# EAGLE design DR55_soundgen (EAGLE 7.1.0)
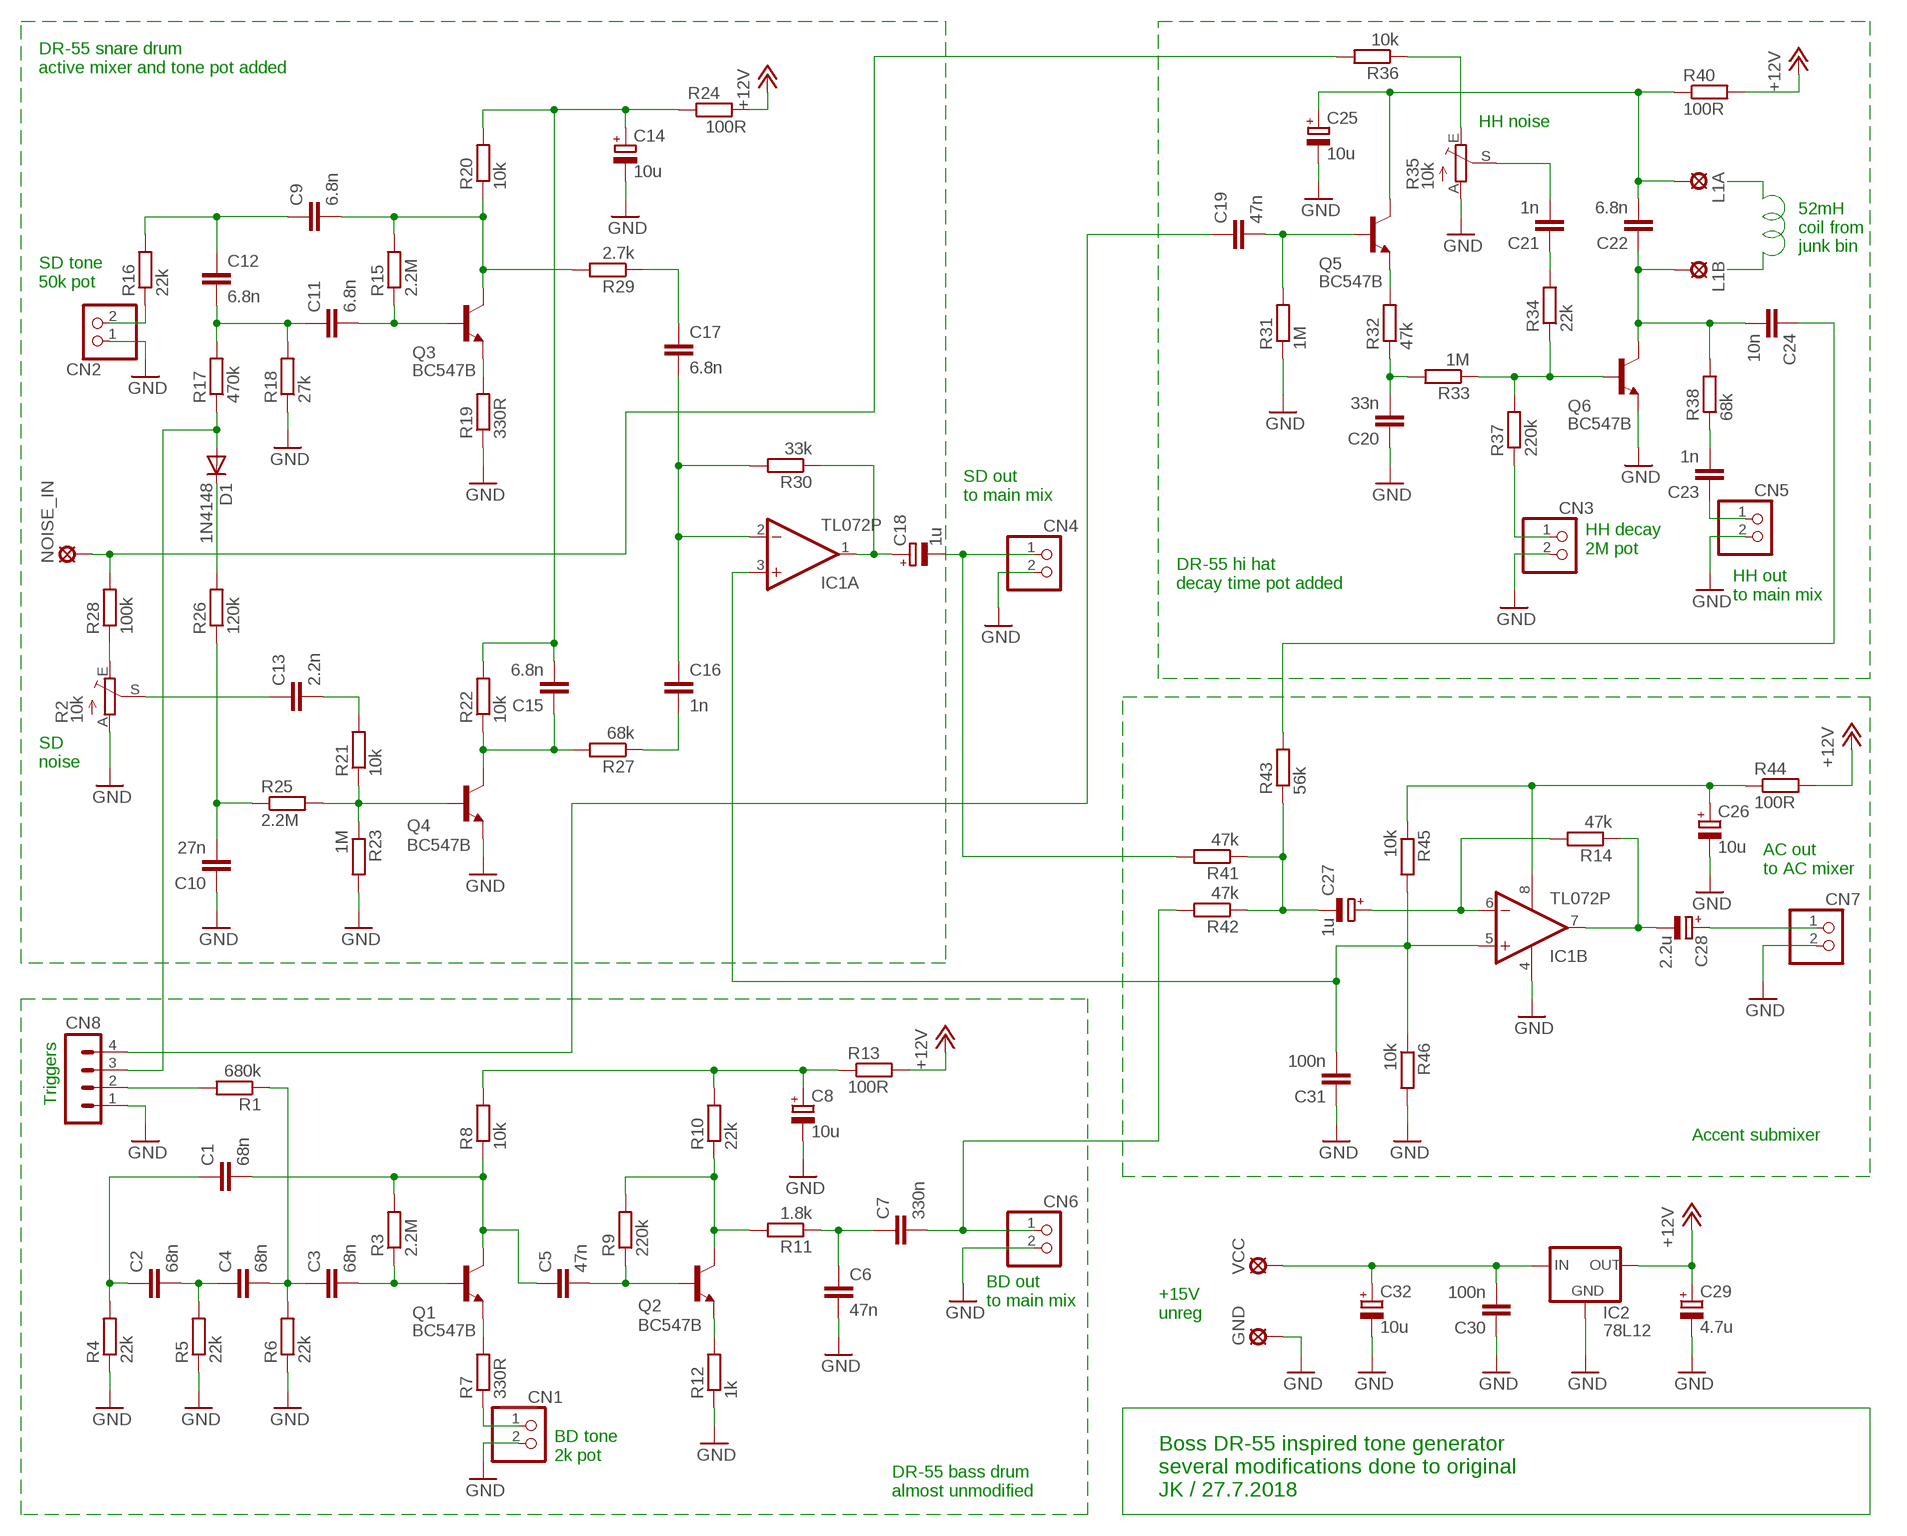
[diagram p0: schematic, sheet 1]

## Parts
C1  68n  C-EUC0805  [C0805]
C2  68n  C-EUC0805  [C0805]
C3  68n  C-EUC0805  [C0805]
C4  68n  C-EUC0805  [C0805]
C5  47n  C-EUC0805  [C0805]
C6  47n  C-EUC0805  [C0805]
C7  330n  C-EUC0805  [C0805]
C8  10u  CPOL-EUE5-5  [E5-5]
C9  6.8n  C-EUC0805  [C0805]
C10  27n  C-EUC0805  [C0805]
C11  6.8n  C-EUC0805  [C0805]
C12  6.8n  C-EUC0805  [C0805]
C13  2.2n  C-EUC0805  [C0805]
C14  10u  CPOL-EUE5-5  [E5-5]
C15  6.8n  C-EU025-024X044  [C025-024X044]
C16  1n  C-EUC0805  [C0805]
C17  6.8n  C-EUC0805  [C0805]
C18  1u  CPOL-EUSMCA  [SMC_A]
C19  47n  C-EUC0805  [C0805]
C20  33n  C-EUC0805  [C0805]
C21  1n  C-EUC0805  [C0805]
C22  6.8n  C-EUC0805  [C0805]
C23  1n  C-EUC0805  [C0805]
C24  10n  C-EUC0805  [C0805]
C25  10u  CPOL-EUE5-5  [E5-5]
C26  10u  CPOL-EUE5-5  [E5-5]
C27  1u  CPOL-EUSMCA  [SMC_A]
C28  2.2u  CPOL-EUE5-5  [E5-5]
C29  4.7u  CPOL-EUSMCA  [SMC_A]
C30  100n  C-EUC0805  [C0805]
C31  100n  C-EUC0805  [C0805]
C32  10u  CPOL-EUE5-5  [E5-5]
CN1  PINHD-1X2  [1X02]
CN2  PINHD-1X2  [1X02]
CN3  PINHD-1X2  [1X02]
CN4  PINHD-1X2  [1X02]
CN5  PINHD-1X2  [1X02]
CN6  PINHD-1X2  [1X02]
CN7  PINHD-1X2  [1X02]
CN8  MA04-1  [MA04-1]
D1  1N4148  DIODE-SOD80C  [SOD80C]
GND  LSP10  [LSP10]
IC1  TL072P  [DIL08]
IC2  78L12  78LXX  [78LXX]
L1A  MCS10B  [MCS10B]
L1B  MCS10B  [MCS10B]
NOISE_IN  LSP10  [LSP10]
Q1  BC547B  [TO92]
Q2  BC547B  [TO92]
Q3  BC547B  [TO92]
Q4  BC547B  [TO92]
Q5  BC547B  [TO92]
Q6  BC547B  [TO92]
R1  680k  R-EU_R0805  [R0805]
R2  10k  TRIM_EU-S63X  [S63X]
R3  2.2M  R-EU_R0805  [R0805]
R4  22k  R-EU_R0805  [R0805]
R5  22k  R-EU_R0805  [R0805]
R6  22k  R-EU_R0805  [R0805]
R7  330R  R-EU_R0805  [R0805]
R8  10k  R-EU_R0805  [R0805]
R9  220k  R-EU_R0805  [R0805]
R10  22k  R-EU_R0805  [R0805]
R11  1.8k  R-EU_R0805  [R0805]
R12  1k  R-EU_R0805  [R0805]
R13  100R  R-EU_R0805  [R0805]
R14  47k  R-EU_R0805  [R0805]
R15  2.2M  R-EU_R0805  [R0805]
R16  22k  R-EU_R0805  [R0805]
R17  470k  R-EU_R0805  [R0805]
R18  27k  R-EU_R0805  [R0805]
R19  330R  R-EU_R0805  [R0805]
R20  10k  R-EU_R0805  [R0805]
R21  10k  R-EU_R0805  [R0805]
R22  10k  R-EU_R0805  [R0805]
R23  1M  R-EU_R0805  [R0805]
R24  100R  R-EU_R0805  [R0805]
R25  2.2M  R-EU_R0805  [R0805]
R26  120k  R-EU_R0805  [R0805]
R27  68k  R-EU_R0805  [R0805]
R28  100k  R-EU_R0805  [R0805]
R29  2.7k  R-EU_R0805  [R0805]
R30  33k  R-EU_R0805  [R0805]
R31  1M  R-EU_R0805  [R0805]
R32  47k  R-EU_0207/10  [0207/10]
R33  1M  R-EU_R0805  [R0805]
R34  22k  R-EU_R0805  [R0805]
R35  10k  TRIM_EU-S63X  [S63X]
R36  10k  R-EU_R0805  [R0805]
R37  220k  R-EU_R0805  [R0805]
R38  68k  R-EU_R0805  [R0805]
R40  100R  R-EU_R0805  [R0805]
R41  47k  R-EU_R0805  [R0805]
R42  47k  R-EU_R0805  [R0805]
R43  56k  R-EU_R0805  [R0805]
R44  100R  R-EU_R0805  [R0805]
R45  10k  R-EU_R0805  [R0805]
R46  10k  R-EU_R0805  [R0805]
VCC  LSP10  [LSP10]

## Nets
+12V: C29.+ IC2.OUT R13.2 R24.2 R40.2 R44.2
+15V: C30.2 C32.+ IC2.IN VCC.MP
GND: C6.2 C8.- C10.1 C14.- C20.1 C25.- C26.- C29.- C30.1 C31.1 C32.- CN1.2 CN2.1 CN3.2 CN4.2 CN5.2 CN6.2 CN7.2 CN8.1 GND.MP IC1.4(P:V-) IC2.GND Q4.1(E) Q6.1(E) R2.A R4.1 R5.1 R6.1 R12.1 R18.1 R19.1 R23.2 R31.1 R35.A R46.2
N$1: C1.1 C2.1 R4.2
N$2: C2.2 C4.1 R5.2
N$3: C3.1 C4.2 R1.1 R6.2
N$4: C3.2 Q1.2(B) R3.1
N$5: Q1.1(E) R7.2
N$6: CN1.1 R7.1
N$7: C1.2 C5.1 Q1.3(C) R3.2 R8.1
N$8: C9.1 C12.1 R16.2
N$9: C5.2 Q2.2(B) R9.1
N$10: R2.E R28.1
N$11: Q2.3(C) R9.2 R10.1 R11.2
N$12: Q2.1(E) R12.2
N$13: C6.1 C7.1 R11.1
N$14: C11.1 C12.2 R17.2 R18.2
N$15: C11.2 Q3.2(B) R15.1
N$16: Q3.1(E) R19.2
N$17: CN2.2 R16.1
N$18: C9.2 Q3.3(C) R15.2 R20.1 R29.2
N$19: D1.C R26.2
N$20: C15.1 Q4.3(C) R22.1 R27.2
N$21: C10.2 R25.1 R26.1
N$22: Q4.2(B) R21.1 R23.1 R25.2
N$23: C13.2 R21.2
N$24: C16.2 R27.1
N$25: C19.2 Q5.2(B) R31.2
N$27: C13.1 R2.S
N$28: C17.1 R29.1
N$29: C16.1 C17.2 IC1.2(A:-IN) R30.2
N$30: Q5.1(E) R32.2
N$31: C18.+ IC1.1(A:OUT) R30.1
N$32: C20.2 R32.1 R33.2
N$33: Q6.2(B) R33.1 R34.1 R37.2
N$34: CN3.1 R37.1
N$36: C22.1 C24.2 L1B.MP Q6.3(C) R38.2
N$37: C23.2 R38.1
N$38: C21.1 R34.2
N$39: C21.2 R35.S
N$40: R35.E R36.1
N$41: C27.- R41.1 R42.1 R43.1
N$42: C28.- IC1.7(B:OUT) R14.1
N$43: C27.+ IC1.6(B:-IN) R14.2
NOISE_IN: NOISE_IN.MP R28.2 R36.2
OUT_AC: C28.+ CN7.1
OUT_BD: C7.2 CN6.1 R42.2
OUT_HH: C23.1 CN5.1
OUT_HH_AC: C24.1 R43.2
OUT_SD: C18.- CN4.1 R41.2
TRIG_BD: CN8.2 R1.2
TRIG_HH: C19.1 CN8.4
TRIG_SD: CN8.3 D1.A R17.1
V_BD: C8.+ R8.2 R10.2 R13.1
V_HH: C22.2 C25.+ L1A.MP Q5.3(C) R40.1
V_MX: C26.+ IC1.8(P:V+) R44.1 R45.1
V_MX/2: C31.2 IC1.3(A:+IN) IC1.5(B:+IN) R45.2 R46.1
V_SD: C14.+ C15.2 R20.2 R22.2 R24.1

## Notes on the sheet
- DR-55 snare drum
  active mixer and tone pot added
- HH noise
- 52mH
  coil from
  junk bin
- SD tone
  50k pot
- SD out
  to main mix
- HH decay
  2M pot
- HH out
  to main mix
- DR-55 hi hat
  decay time pot added
- SD
  noise
- AC out
  to AC mixer
- Triggers
- Accent submixer
- BD out
  to main mix
- +15V
  unreg
- BD tone
  2k pot
- DR-55 bass drum
  almost unmodified
- Boss DR-55 inspired tone generator
  several modifications done to original
  JK / 27.7.2018

## Library data of the parts
C1-C7 C9-C13 C15-C17 C19-C24 C30 C31 = rcl:C-EU: CAPACITOR, European symbol
C8 C14 C18 C25-C29 C32 = rcl:CPOL-EU: POLARIZED CAPACITOR, European symbol
CN1-CN7 = pinhead:PINHD-1X2: PIN HEADER
CN8 = con-lstb:MA04-1: PIN HEADER; OC_FARNELL: unknown; OC_NEWARK: unknown
D1 = diode:DIODE-: DIODE
GND NOISE_IN VCC = solpad:LSP10: SOLDER PAD drill 1.0 mm, distributor Buerklin, 12H555
IC1 = linear:TL072: OP AMP
IC2 = v-reg:78LXX: VOLTAGE REGULATOR
L1A L1B = solpad:MCS10B: SOLDER PAD MC S1, distributor Buerklin, 15F505
Q1-Q6 = transistor-npn:BC547*: NPN Transistor
R1 R3-R34 R36-R38 R40-R46 = rcl:R-EU_: RESISTOR, European symbol
R2 R35 = pot:TRIM_EU-: POTENTIOMETER

## Board
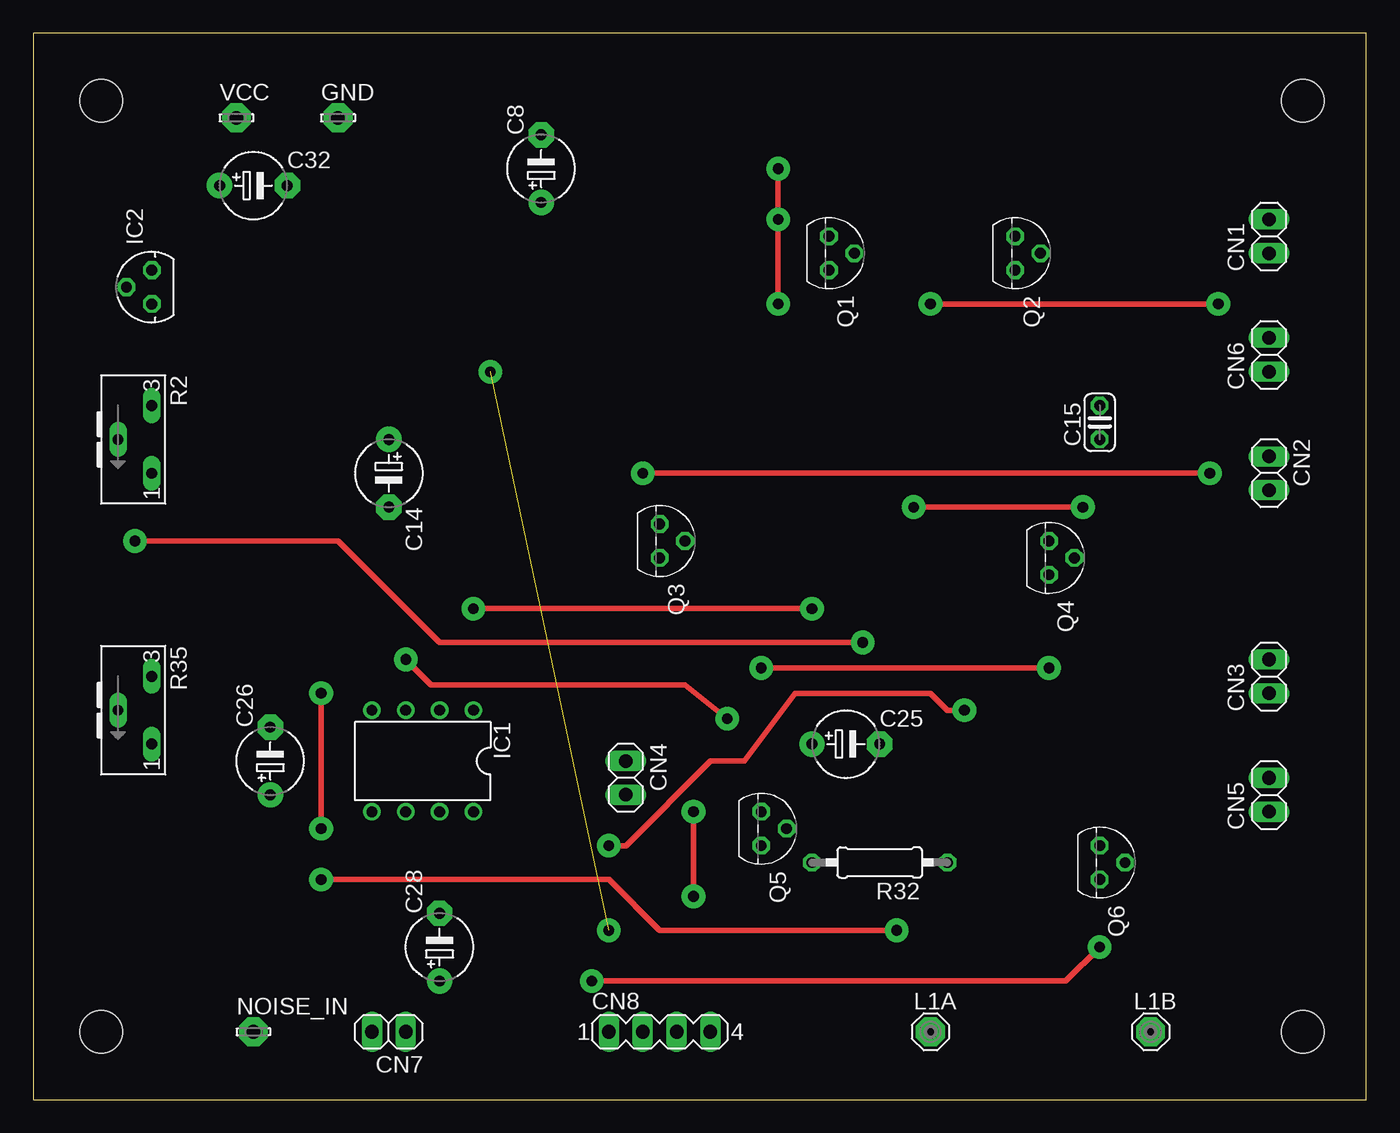
[diagram p1: board, top side]
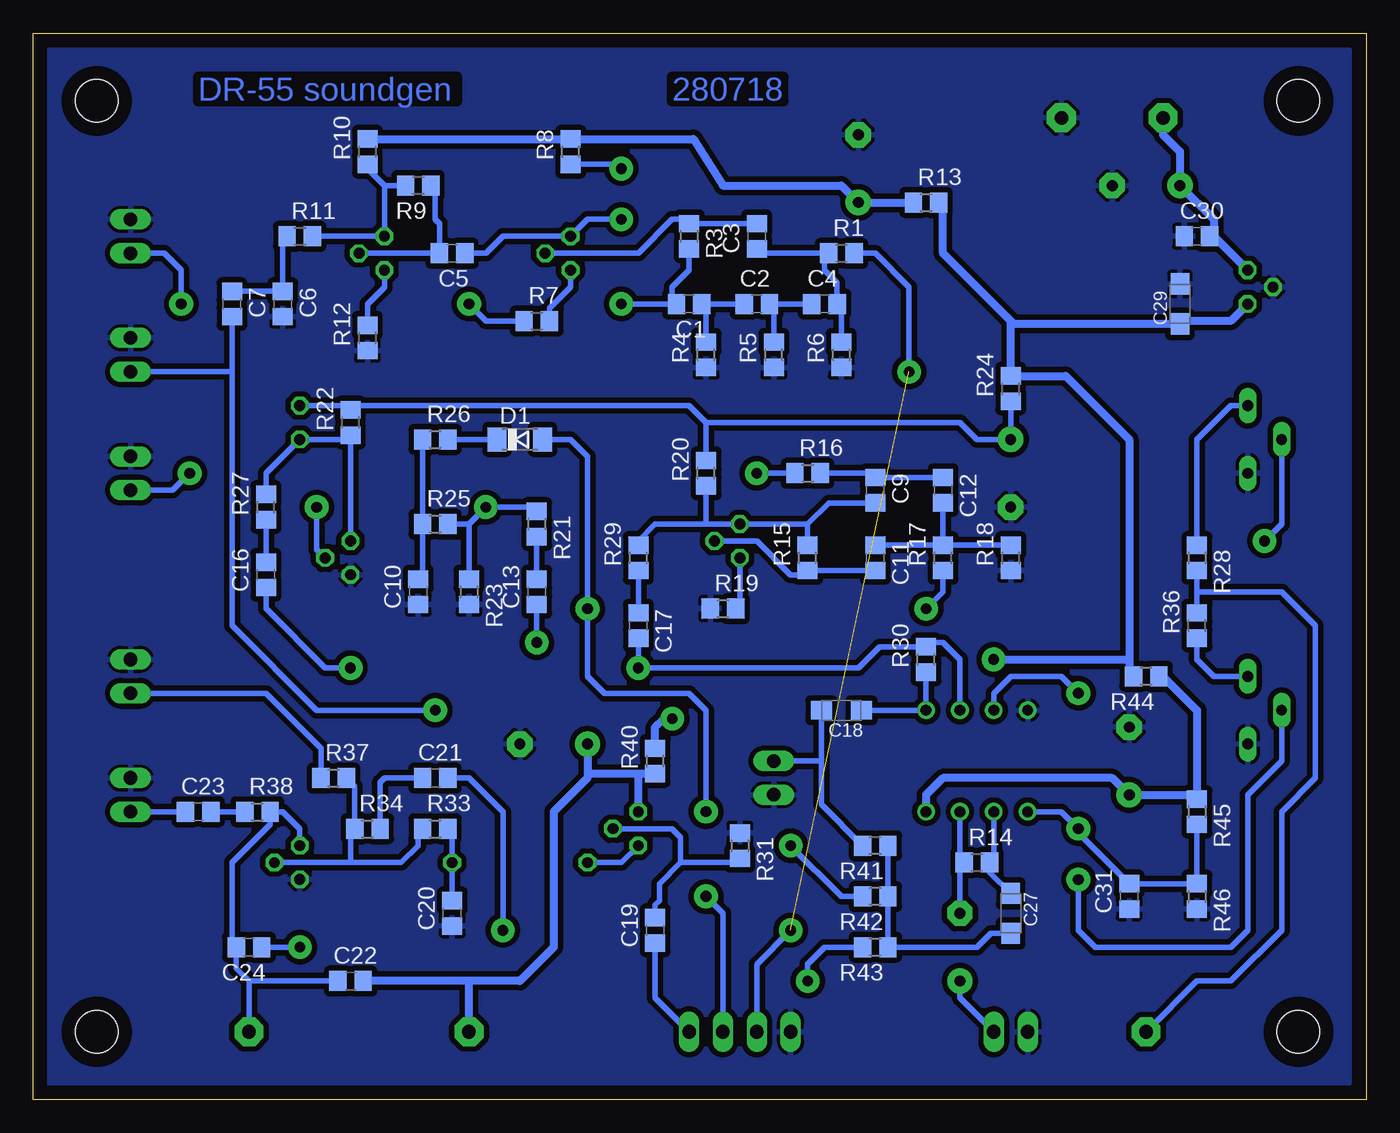
[diagram p2: board, bottom side, seen from below]

Size 100 x 80 mm. Coordinates in mm from the lower left corner, seen from the top.
Outline: 0,0 100,0 100,80 0,80 0,0
Copper layers (1*16): Top 0.035mm / dielectric 1.5mm / Bottom 0.035mm
Design rules "default": minimum track width 10mil, minimum drill 24mil, track to track 8mil, track to pad 8mil, pad to pad 8mil, via to via 8mil, smd to smd 8mil, copper to edge 40mil, drill to drill 8mil, minimum pad ring 10mil, minimum via ring 8mil, stop-mask expansion 4mil, vias tented up to drill 0mil, thermal gap 10mil
Holes 3.2 mm at 5.08,5.08 5.08,74.93 95.25,74.93 95.25,5.08

### Footprints (pad centres in the part's own frame; a part is rotated, then mirrored left to right if it is on the bottom)
C0805 = smd 1.3 x 1.5: 1 -0.95,0; 2 0.95,0
E5-5 = drill 0.813 pad 1.905: + -2.54,0 | drill 0.813 pad 1.905 octagon: - 2.54,0
C025-024X044 = drill 0.813 octagon: 1 -1.27,0; 2 1.27,0
SMC_A = smd 1.6 x 1.4: + -1.5,0; - 1.5,0
1X02 = drill 1.016 long: 1 -1.27,0; 2 1.27,0
MA04-1 = drill 1.016 long: 1 -3.81,0; 2 -1.27,0; 3 1.27,0; 4 3.81,0
SOD80C = smd 1.4 x 1.8: A 1.7,0; C -1.7,0
LSP10 = drill 1.016 pad 2.159 octagon: MP 0,0
DIL08 = drill 0.813 pad 1.27: 1 -3.81,-3.81; 2 -1.27,-3.81; 3 1.27,-3.81; 4 3.81,-3.81; 5 3.81,3.81; 6 1.27,3.81; 7 -1.27,3.81; 8 -3.81,3.81
78LXX = drill 0.813 octagon: GND 0,1.905; IN 1.27,0; OUT -1.27,0
MCS10B = drill 1.016 pad 2.159 octagon: MP 0,0
TO92 = drill 0.813 octagon: 1 1.27,0; 2 0,1.905; 3 -1.27,0
R0805 = smd 1.3 x 1.5: 1 -0.95,0; 2 0.95,0
S63X = drill 0.813 long: A 2.54,0; E -2.54,0; S 0,-2.54
0207/10 = drill 0.813 octagon: 1 -5.08,0; 2 5.08,0

### Placement (x,y rotation side)
C1  50.8,59.69 180 bottom
C2  45.72,59.69 0 bottom
C3  45.72,64.77 90 bottom
C4  40.64,59.69 0 bottom
C5  68.58,63.5 180 bottom
C6  81.28,59.69 270 bottom
C7  85.09,59.69 270 bottom
C8  38.1,69.85 90 top
C9  36.83,45.72 270 bottom
C10  71.12,38.1 90 bottom
C11  36.83,40.64 270 bottom
C12  31.75,45.72 270 bottom
C13  62.23,38.1 90 bottom
C14  26.67,46.99 270 top
C15  80.01,50.8 90 top
C16  82.55,39.37 90 bottom
C17  54.61,35.56 270 bottom
C18  39.37,29.21 180 bottom
C19  53.34,12.7 90 bottom
C20  68.58,13.97 90 bottom
C21  69.85,24.13 0 bottom
C22  76.2,8.89 0 bottom
C23  87.63,21.59 0 bottom
C24  83.82,11.43 180 bottom
C25  60.96,26.67 0 top
C26  17.78,25.4 90 top
C27  26.67,13.97 270 bottom
C28  30.48,11.43 90 top
C29  13.97,59.69 90 bottom
C30  12.7,64.77 0 bottom
C31  17.78,15.24 90 bottom
C32  16.51,68.58 0 top
CN1  92.71,64.77 90 top
CN2  92.71,46.99 270 top
CN3  92.71,31.75 90 top
CN4  44.45,24.13 270 top
CN5  92.71,22.86 90 top
CN6  92.71,55.88 90 top
CN7  26.67,5.08 180 top
CN8  46.99,5.08 0 top
D1  63.5,49.53 0 bottom
GND  22.86,73.66 0 top
IC1  29.21,25.4 180 top
IC2  8.89,60.96 90 top
L1A  67.31,5.08 0 top
L1B  83.82,5.08 0 top
NOISE_IN  16.51,5.08 0 top
Q1  59.69,63.5 270 top
Q2  73.66,63.5 270 top
Q3  46.99,41.91 270 top
Q4  76.2,40.64 270 top
Q5  54.61,20.32 270 top
Q6  80.01,17.78 270 top
R1  39.37,63.5 0 bottom
R2  8.89,49.53 270 top
R3  50.8,64.77 270 bottom
R4  49.53,55.88 90 bottom
R5  44.45,55.88 90 bottom
R6  39.37,55.88 90 bottom
R7  62.23,58.42 0 bottom
R8  59.69,71.12 90 bottom
R9  71.12,68.58 180 bottom
R10  74.93,71.12 90 bottom
R11  80.01,64.77 0 bottom
R12  74.93,57.15 90 bottom
R13  33.02,67.31 0 bottom
R14  29.21,17.78 0 bottom
R15  41.91,40.64 90 bottom
R16  41.91,46.99 0 bottom
R17  31.75,40.64 90 bottom
R18  26.67,40.64 90 bottom
R19  48.26,36.83 0 bottom
R20  49.53,46.99 90 bottom
R21  62.23,43.18 270 bottom
R22  76.2,50.8 90 bottom
R23  67.31,38.1 270 bottom
R24  26.67,53.34 90 bottom
R25  69.85,43.18 0 bottom
R26  69.85,49.53 0 bottom
R27  82.55,44.45 90 bottom
R28  12.7,40.64 270 bottom
R29  54.61,40.64 90 bottom
R30  33.02,33.02 90 bottom
R31  46.99,19.05 270 bottom
R32  63.5,17.78 180 top
R33  69.85,20.32 0 bottom
R34  74.93,20.32 0 bottom
R35  8.89,29.21 270 top
R36  12.7,35.56 90 bottom
R37  77.47,24.13 0 bottom
R38  83.19,21.59 0 bottom
R40  53.34,25.4 90 bottom
R41  36.83,19.05 180 bottom
R42  36.83,15.24 180 bottom
R43  36.83,11.43 180 bottom
R44  16.51,31.75 180 bottom
R45  12.7,21.59 270 bottom
R46  12.7,15.24 270 bottom
VCC  15.24,73.66 0 top

### Tracks (layer width: path | path; a pad name or v marks a point on that pad's centre or on a via)
+12V  (via drill 0.8 pad 1.78)
  Top 0.406: v52.07,28.57 48.9,31.11 29.84,31.11 v27.94,33.02
  Bottom 0.406: 13.74,58.42 C29.+ | 31.75,66.99 R13.2 | 17.78,32.07 R44.2
  Bottom 0.61: IC2.OUT 10.16,58.42 13.74,58.42 | C29.+ 26.44,58.19 | 26.44,58.19 26.67,58.19 R24.2 22.54,54.29 17.78,49.53 17.78,33.02 | 26.44,58.19 31.75,63.5 31.75,66.99 | R40.2 53.34,27.94 52.7,28.57 v52.07,28.57 | v27.94,33.02 17.78,33.02 | 17.78,33.02 17.78,32.07
+15V
  Bottom 0.406: 11.43,65.09 C30.2 11.43,64.77
  Bottom 0.61: VCC.MP 15.24,72.39 13.97,71.12 C32.+ 11.43,66.04 11.43,65.09 | 11.43,64.77 IC2.IN
GND
  pour Bottom (isolate 0.406): 1.27,78.74 99.06,78.74 99.06,1.27 1.27,1.27
N$1
  Bottom 0.406: R4.2 49.53,59.37 C1.1 C2.1
N$2
  Bottom 0.406: R5.2 44.45,59.37 C2.2 C4.1
N$3
  Bottom 0.406: R6.2 39.37,59.37 C4.2 39.69,61.28 40.64,62.23 40.64,63.18 R1.1 45.4,63.5 C3.1
N$4
  Bottom 0.406: Q1.2 54.61,63.5 52.07,66.04 51.12,66.04 R3.1 C3.2
N$5
  Bottom 0.406: R7.2 61.28,59.37 59.69,60.96 Q1.1
N$6  (via drill 0.8 pad 1.78)
  Top 0.406: v67.31,59.69 v88.9,59.69
  Bottom 0.406: R7.1 66.04,58.42 v67.31,59.69 | v88.9,59.69 88.9,62.23 90.17,63.5 CN1.1
N$7  (via drill 0.8 pad 1.78)
  Top 0.406: v55.88,59.69 v55.88,66.04 v55.88,69.85
  Bottom 0.406: C5.1 66.04,63.5 64.77,64.77 Q1.3 58.42,66.04 v55.88,66.04 | R3.2 50.8,62.23 52.07,60.96 52.07,60.01 C1.2 v55.88,59.69 | R8.1 56.2,70.17 v55.88,69.85
N$8
  Bottom 0.406: C12.1 C9.1 37.15,46.99 R16.2
N$9
  Bottom 0.406: Q2.2 C5.2 69.53,65.72 69.85,66.04 69.85,68.26 R9.1
N$10
  Bottom 0.406: R28.1 12.7,49.53 10.16,52.07 R2.E
N$11
  Bottom 0.406: R11.2 Q2.3 73.66,68.58 | 73.66,68.58 R9.2 | R10.1 74.93,69.85 73.66,68.58
N$12
  Bottom 0.406: Q2.1 73.66,60.96 74.93,59.69 R12.2
N$13
  Bottom 0.406: C6.1 81.28,64.77 R11.1 | 81.59,60.33 C6.1 | 81.6,60.96 C6.1 | C7.1 C6.1
N$14
  Bottom 0.406: C12.2 R17.2 | R18.2 R17.2 | R17.2 C11.1
N$15
  Bottom 0.406: Q3.2 45.72,41.91 43.18,39.37 42.23,39.37 R15.1 C11.2
N$16
  Bottom 0.406: Q3.1 46.99,37.15 R19.2
N$17  (via drill 0.8 pad 1.78)
  Top 0.406: v45.72,46.99 v88.27,46.99
  Bottom 0.406: R16.1 v45.72,46.99 | v88.27,46.99 89.53,45.72 CN2.2
N$18
  Bottom 0.406: C9.2 40.32,44.77 41.91,43.18 | 41.91,43.18 R15.2 | 41.91,43.18 Q3.3 49.53,43.18 | 49.53,43.18 53.34,43.18 54.61,41.91 R29.2 | R20.1 49.53,43.18
N$19
  Bottom 0.406: D1.C R26.2
N$20
  Bottom 0.406: R27.2 82.55,46.99 C15.1 76.52,49.53 R22.1 Q4.3
N$21
  Bottom 0.406: R26.1 R25.1 70.8,39.37 C10.2
N$22  (via drill 0.8 pad 1.78)
  Top 0.406: v78.74,44.45 v66.04,44.45
  Bottom 0.406: Q4.2 78.74,41.27 v78.74,44.45 | R21.1 62.55,44.45 v66.04,44.45 67.31,43.18 | 67.31,43.18 R23.1 | R25.2 67.31,43.18
N$23
  Bottom 0.406: R21.2 C13.2
N$24
  Bottom 0.406: R27.1 C16.2
N$25
  Bottom 0.406: Q5.2 52.07,20.32 51.44,19.68 51.44,17.78 | 51.44,17.78 47.31,17.78 R31.2 | C19.2 53.34,14.61 53.02,14.92 53.02,16.19 51.44,17.78
N$27  (via drill 0.8 pad 1.78)
  Top 0.406: v7.62,41.91 22.86,41.91 30.48,34.29 v62.23,34.29
  Bottom 0.406: R2.S 6.35,43.18 v7.62,41.91 | v62.23,34.29 C13.1
N$28
  Bottom 0.406: R29.1 C17.1
N$29  (via drill 0.8 pad 1.78)
  Top 0.406: v54.61,32.38 v76.2,32.38
  Bottom 0.406: IC1.2 30.48,33.02 31.75,34.29 32.7,34.29 R30.2 36.52,33.97 38.1,32.38 v54.61,32.38 C17.2 | v76.2,32.38 78.11,32.38 82.55,36.83 C16.1
N$30
  Bottom 0.406: Q5.1 55.88,17.78 R32.2
N$31
  Bottom 0.406: C18.+ IC1.1 R30.1
N$32
  Bottom 0.406: R33.2 68.58,20 R32.1 C20.2
N$33
  Bottom 0.406: Q6.2 76.2,17.78 | 76.2,17.78 76.2,20 R34.1 75.88,23.49 R37.2 | 76.2,17.78 72.39,17.78 71.12,19.05 71.12,20 R33.1
N$34
  Bottom 0.406: R37.1 78.42,26.35 82.55,30.48 CN3.1
N$36
  Bottom 0.406: Q6.3 80.01,20.32 81.28,21.59 R38.2 82.23,20.64 85.09,17.78 85.09,11.75 C24.2 84.77,9.84 83.82,8.89 | 83.82,8.89 C22.1 | L1B.MP 83.82,8.89
N$37
  Bottom 0.406: C23.2 R38.1
N$38
  Bottom 0.406: R34.2 73.98,23.81 73.66,24.13 C21.1
N$39  (via drill 0.8 pad 1.78)
  Top 0.406: v21.59,16.51 43.18,16.51 46.99,12.7 v64.77,12.7
  Bottom 0.406: R35.S 6.35,25.4 8.89,22.86 8.89,12.7 10.16,11.43 20.32,11.43 21.59,12.7 v21.59,16.51 | C21.2 67.31,24.13 64.77,21.59 v64.77,12.7
N$40
  Bottom 0.406: R35.E 11.43,31.75 12.7,33.02 R36.1
N$41
  Bottom 0.406: R41.1 R42.1 R43.1 29.21,11.43 28.17,12.47 C27.-
N$42
  Bottom 0.406: IC1.7 30.48,18.1 R14.1 30.48,17.78 C28.-
N$43
  Bottom 0.406: IC1.6 27.94,18.1 R14.2 28.26,17.06 C27.+
NOISE_IN
  Bottom 0.406: R28.2 12.7,38.1 | 12.7,38.1 R36.2 | NOISE_IN.MP 12.7,8.89 10.16,8.89 6.35,12.7 6.35,21.59 3.81,24.13 3.81,35.56 6.35,38.1 12.7,38.1
OUT_AC
  Bottom 0.406: C28.+ 30.48,7.62 CN7.1
OUT_BD  (via drill 0.8 pad 1.78)
  Top 0.406: v69.85,29.21 68.58,29.21 67.31,30.48 57.15,30.48 53.34,25.4 50.8,25.4 44.45,19.05 v43.18,19.05
  Bottom 0.406: CN6.1 85.09,54.61 | 85.09,54.61 C7.2 | 85.09,54.61 85.09,35.56 78.74,29.21 v69.85,29.21 | v43.18,19.05 39.37,15.24 R42.2
OUT_HH
  Bottom 0.406: CN5.1 C23.1
OUT_HH_AC  (via drill 0.8 pad 1.78)
  Top 0.406: v41.91,8.89 77.47,8.89 v80.01,11.43
  Bottom 0.406: R43.2 40.64,11.43 41.91,10.16 v41.91,8.89 | C24.1 v80.01,11.43
OUT_SD
  Bottom 0.406: C18.- 40.87,25.4 | 40.87,25.4 40.87,22.14 R41.2 | CN4.1 40.87,25.4
TRIG_BD  (via drill 0.8 pad 1.78)  (1 unrouted)
  Bottom 0.406: R1.2 36.83,63.5 34.29,60.96 v34.29,54.61 | CN8.2 45.72,10.16 v43.18,12.7
TRIG_HH
  Bottom 0.406: C19.1 53.34,7.62 CN8.4
TRIG_SD  (via drill 0.8 pad 1.78)
  Top 0.406: v33.02,36.83 v58.42,36.83 | v49.53,21.59 v49.53,15.24
  Bottom 0.406: R17.1 31.75,38.1 v33.02,36.83 | D1.A 59.69,49.53 58.42,48.26 v58.42,36.83 58.42,31.75 57.15,30.48 50.8,30.48 49.53,29.21 v49.53,21.59 | v49.53,15.24 48.26,13.97 CN8.3
V_BD
  Bottom 0.61: R10.2 R8.2 50.48,72.07 48.26,68.58 39.37,68.58 C8.+ R13.1
V_HH
  Bottom 0.406: 58.1,24.45 58.42,24.13
  Bottom 0.61: C25.+ 58.42,24.13 60.96,21.59 60.96,11.43 63.5,8.89 67.31,8.89 | 67.31,8.89 C22.2 | L1A.MP 67.31,8.89 | R40.1 54.61,24.45 | 54.61,24.45 58.1,24.45 | Q5.3 54.61,24.45
V_MX
  Bottom 0.406: 12.7,22.86 13.02,22.86 R45.1 | R44.1 15.24,31.75
  Bottom 0.61: IC1.8 33.02,22.86 31.75,24.13 19.05,24.13 C26.+ 13.02,22.86 | 12.7,22.86 12.7,29.21 15.24,31.75
V_MX/2  (via drill 0.8 pad 1.78)
  Top 0.406: v21.59,30.48 v21.59,20.32
  Bottom 0.406: R45.2 R46.1 C31.2 21.59,20 v21.59,20.32 22.86,21.59 IC1.5 | IC1.3 27.94,30.48 26.67,31.75 22.86,31.75 v21.59,30.48
V_SD
  Bottom 0.406: R24.1 C14.+ 29.21,49.53 30.48,50.8 49.53,50.8 | 49.53,50.8 50.8,52.07 75.88,52.07 R22.2 76.52,52.07 C15.2 | R20.2 49.53,50.8

### Text on the board
Bottom: 280718 | DR-55 soundgen